# EAGLE design Type-C (EAGLE 9.5.2)
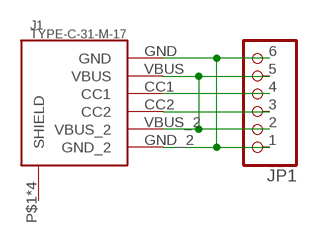
[diagram p0: schematic, sheet 1]

## Parts
J1  TYPE-C-31-M-17  [TYPE-C-31-M-17]
JP1  PINHD-1X6/OCT  [1X06/OCT]

## Nets
N$1: J1.VBUS J1.VBUS_2 JP1.2 JP1.5
N$2: J1.GND J1.GND_2 JP1.1 JP1.6
N$3: J1.CC1 JP1.4
N$4: J1.CC2 JP1.3
Unconnected: J1.P$1(SHIELD) J1.P$2(SHIELD) J1.P$3(SHIELD) J1.P$4(SHIELD)

## Library data of the parts
J1 = angrypig7_Library:TYPE-C-31-M-17
JP1 = pinhead_v2:PINHD-1X6: PIN HEADER

## Board
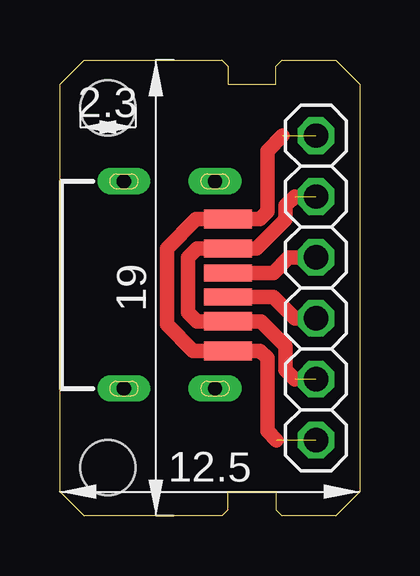
[diagram p1: board, top side]
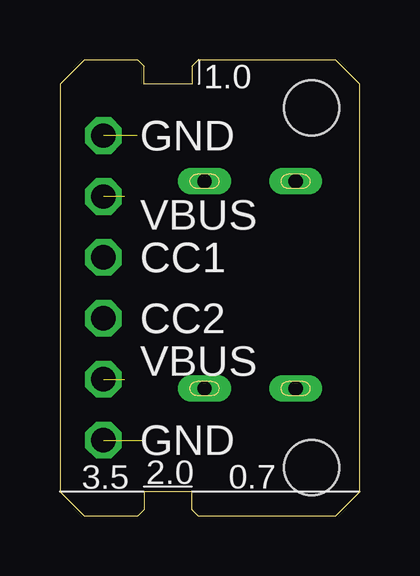
[diagram p2: board, bottom side, seen from below]

Size 12.5 x 19 mm. Coordinates in mm from the lower left corner, seen from the top.
Outline: 0,1 0,18 1,19 6.75,19 7,18.75 7,18 9,18 9,18.75 9.25,19 11.5,19 12.5,18 12.5,1 11.5,0 9.25,0 9,0.25 9,1 7,1 7,0.25 6.75,0 1,0 0,1
Copper layers (1*16): Top 0.035mm / dielectric 1.5mm / Bottom 0.035mm
Design rules "default *": minimum track width 6mil, minimum drill 0.35mm, track to track 6mil, track to pad 6mil, pad to pad 6mil, via to via 6mil, smd to smd 6mil, copper to edge 4mil, drill to drill 6mil, minimum pad ring 10mil, minimum via ring 8mil, stop-mask expansion 4mil, vias tented up to drill 0mil, thermal gap 10mil
Holes 2.3 mm at 2,17 2,2

### Footprints (pad centres in the part's own frame; a part is rotated, then mirrored left to right if it is on the bottom)
TYPE-C-31-M-17 = smd 0.7 x 2: CC1 -0.5,0.4; CC2 0.5,0.4 | smd 0.8 x 2: GND -2.75,0.4; GND_2 2.75,0.4 | drill 0.6 pad 1.1 long: P$1 4.32,-3.95; P$2 4.32,-0.15; P$3 -4.32,-0.15; P$4 -4.32,-3.95 | smd 0.76 x 2: VBUS -1.52,0.4; VBUS_2 1.52,0.4
1X06/OCT = drill 1.016 octagon: 1 -6.35,0; 2 -3.81,0; 3 -1.27,0; 4 1.27,0; 5 3.81,0; 6 6.35,0

### Placement (x,y rotation side)
J1  6.62,9.62 270 top
JP1  10.68,9.49 90 top

### Tracks (layer width: path | path; a pad name or v marks a point on that pad's centre or on a via)
N$1  (2 unrouted)
  Top 0.61: 9.79,5.68 9.41,6.06 9.41,7.08 8.39,8.1 J1.VBUS_2 5.73,8.1 5.35,8.48 5.35,10.76 5.73,11.14 J1.VBUS 8.2,11.14 9.41,12.35 9.41,12.92 9.79,13.3
N$2  (2 unrouted)
  Top 0.61: 9.29,15.84 8.65,15.21 8.65,12.67 8.35,12.37 J1.GND 5.69,12.37 4.46,11.14 4.46,7.97 5.56,6.87 J1.GND_2 8.35,6.87 8.65,6.57 8.65,3.52 9.03,3.14
N$3
  Top 0.61: J1.CC1 8.9,10.12 9.54,10.76 JP1.4
N$4
  Top 0.61: J1.CC2 8.9,9.12 9.79,8.22 JP1.3

### Text on the board
bPlace: 1.0 | GND | VBUS | CC1 | CC2 | VBUS | GND | 0.7 | 2.0 | 3.5